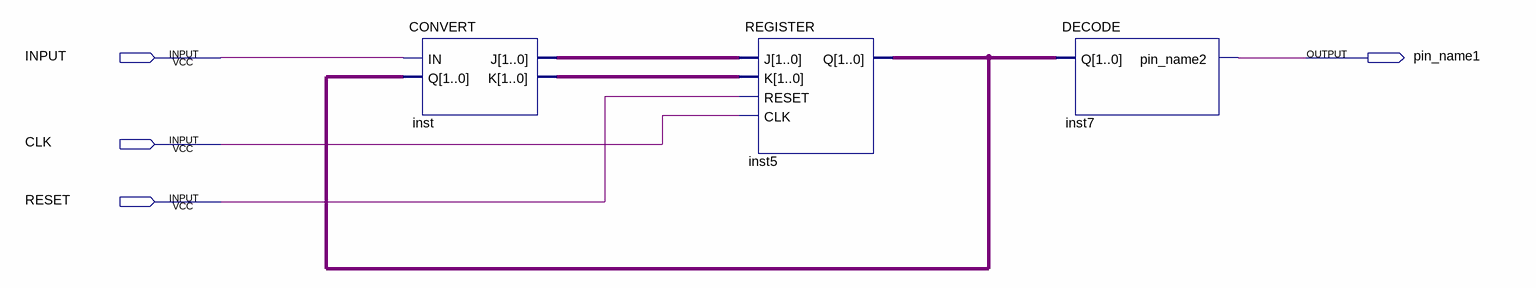
[diagram p0: schematic sheet]
// Quartus schematic Check111.bdf as structural Verilog: 3 symbols, 4 pins
module Check111 (
  input  INPUT,
  input  CLK,
  input  RESET,
  output pin_name1
);

  wire [1:0] inst5_q, inst_j, inst_k;

  CONVERT inst (.IN(INPUT), .Q(inst5_q), .J(inst_j), .K(inst_k));
  REGISTER inst5 (.J(inst_j), .K(inst_k), .RESET(RESET), .CLK(CLK), .Q(inst5_q));
  DECODE inst7 (.Q(inst5_q), .pin_name2(pin_name1));
endmodule
